# Altium schematic sheet Input.SchDoc
size 420 x 297 mm; Address1: Address1; Address2: Address2; Address3: Address3; Address4: Address4; DocumentNumber: АБВГ.123456.001 Э3; SheetNumber: 1; Scale: 1:1; DocumentType: Схема электрическая принципиальная; FirstReferrence: АБВГ.123456.001
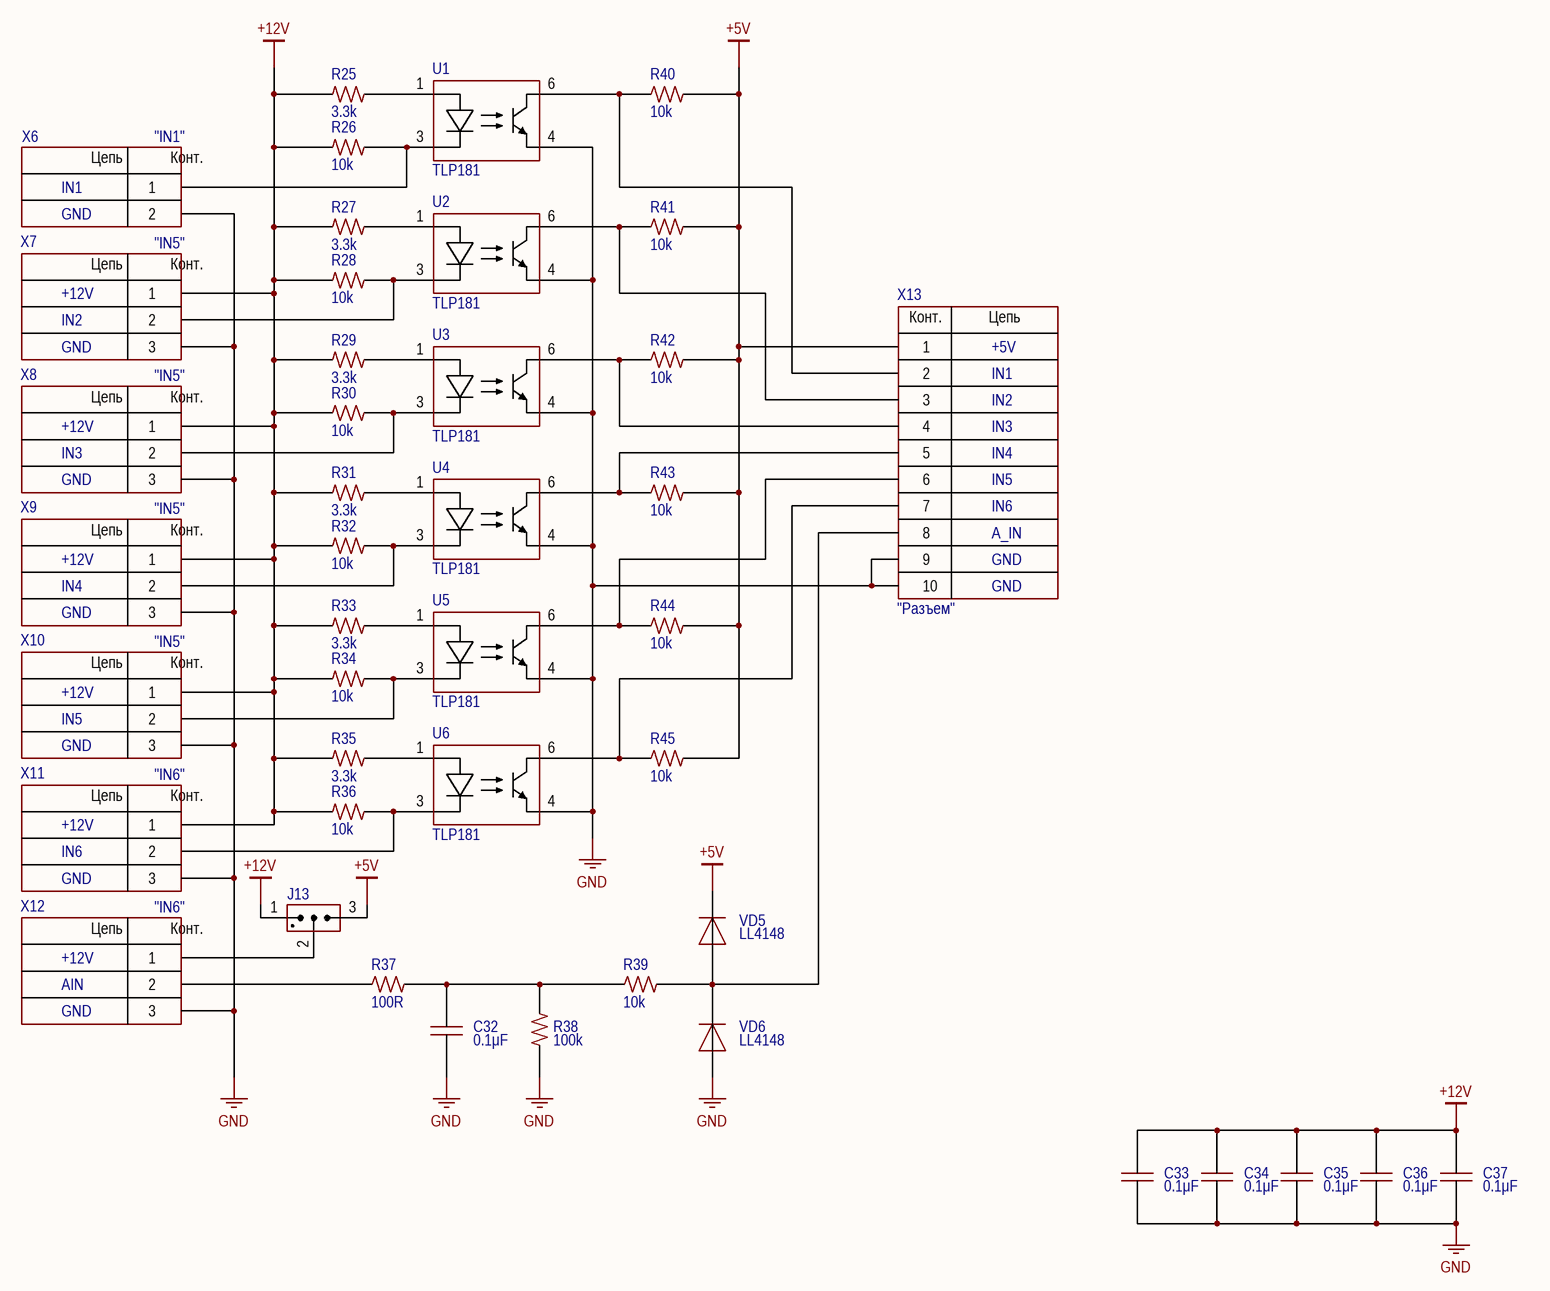
[diagram p0: Input.SchDoc]

## Parts
C32  value 0.1μF  [CAP: 0805]
C33  value 0.1μF  [CAP: 0805]
C34  value 0.1μF  [CAP: 0805]
C35  value 0.1μF  [CAP: 0805]
C36  value 0.1μF  [CAP: 0805]
C37  value 0.1μF  [CAP: 0805]
J13  (no value)  [CON: PLS-3]
R25  Значение: 3.3k  [RES: 0805]  (hidden comment: Резистор SMD)
R26  Значение: 10k  [RES: 0805]  (hidden comment: Резистор SMD)
R27  Значение: 3.3k  [RES: 0805]  (hidden comment: Резистор SMD)
R28  Значение: 10k  [RES: 0805]  (hidden comment: Резистор SMD)
R29  Значение: 3.3k  [RES: 0805]  (hidden comment: Резистор SMD)
R30  Значение: 10k  [RES: 0805]  (hidden comment: Резистор SMD)
R31  Значение: 3.3k  [RES: 0805]  (hidden comment: Резистор SMD)
R32  Значение: 10k  [RES: 0805]  (hidden comment: Резистор SMD)
R33  Значение: 3.3k  [RES: 0805]  (hidden comment: Резистор SMD)
R34  Значение: 10k  [RES: 0805]  (hidden comment: Резистор SMD)
R35  Значение: 3.3k  [RES: 0805]  (hidden comment: Резистор SMD)
R36  Значение: 10k  [RES: 0805]  (hidden comment: Резистор SMD)
R37  Значение: 100R  [RES: 0805]  (hidden comment: Резистор SMD)
R38  Значение: 100k  [RES: 0805]  (hidden comment: Резистор SMD)
R39  Значение: 10k  [RES: 0805]  (hidden comment: Резистор SMD)
R40  Значение: 10k  [RES: 0805]  (hidden comment: Резистор SMD)
R41  Значение: 10k  [RES: 0805]  (hidden comment: Резистор SMD)
R42  Значение: 10k  [RES: 0805]  (hidden comment: Резистор SMD)
R43  Значение: 10k  [RES: 0805]  (hidden comment: Резистор SMD)
R44  Значение: 10k  [RES: 0805]  (hidden comment: Резистор SMD)
R45  Значение: 10k  [RES: 0805]  (hidden comment: Резистор SMD)
U1  (no value)  [OPTO: TLP181]
U2  (no value)  [OPTO: TLP181]
U3  (no value)  [OPTO: TLP181]
U4  (no value)  [OPTO: TLP181]
U5  (no value)  [OPTO: TLP181]
U6  (no value)  [OPTO: TLP181]
VD5  PartNumber: LL4148  [DIODE: SOD80]
VD6  PartNumber: LL4148  [DIODE: SOD80]
X6  CommentText: "IN1"  [CON: 15EDGVC-3.5-02 (or 691321100002)]
X7  CommentText: "IN5"  [CON: 15EDGVC-3.5-03 (or 691321100003)]
X8  CommentText: "IN5"  [CON: 15EDGVC-3.5-03 (or 691321100003)]
X9  CommentText: "IN5"  [CON: 15EDGVC-3.5-03 (or 691321100003)]
X10  CommentText: "IN5"  [CON: 15EDGVC-3.5-03 (or 691321100003)]
X11  CommentText: "IN6"  [CON: 15EDGVC-3.5-03 (or 691321100003)]
X12  CommentText: "IN6"  [CON: 15EDGVC-3.5-03 (or 691321100003)]
X13  CommentText: "Разъем"  [CON: PLS-10]

## Nets
+5V: J13.3(IN) R40.2 R41.2 R42.2 R43.2 R44.2 R45.2 VD5.2 X13.1
+12V: C33.2 C34.2 C35.2 C36.2 C37.2 J13.1(IN) R25.1 R26.1 R27.1 R28.1 R29.1 R30.1 R31.1 R32.1 R33.1 R34.1 R35.1 R36.1 X7.1 X8.1 X9.1 X10.1 X11.1
GND: C32.1 C33.1 C34.1 C35.1 C36.1 C37.1 R38.1 U1.4(E) U2.4(E) U3.4(E) U4.4(E) U5.4(E) U6.4(E) VD6.1 X6.2 X7.3 X8.3 X9.3 X10.3 X11.3 X12.3 X13.9 X13.10
NetC32_2: C32.2 R37.2 R38.2 R39.1
NetJ13_2: J13.2(IN) X12.1
NetR25_2: R25.2 U1.1(A)
NetR26_2: R26.2 U1.3(C) X6.1
NetR27_2: R27.2 U2.1(A)
NetR28_2: R28.2 U2.3(C) X7.2
NetR29_2: R29.2 U3.1(A)
NetR30_2: R30.2 U3.3(C) X8.2
NetR31_2: R31.2 U4.1(A)
NetR32_2: R32.2 U4.3(C) X9.2
NetR33_2: R33.2 U5.1(A)
NetR34_2: R34.2 U5.3(C) X10.2
NetR35_2: R35.2 U6.1(A)
NetR36_2: R36.2 U6.3(C) X11.2
NetR37_1: R37.1 X12.2
NetR39_2: R39.2 VD5.1 VD6.2 X13.8
NetR40_1: R40.1 U1.6(C) X13.2
NetR41_1: R41.1 U2.6(C) X13.3
NetR42_1: R42.1 U3.6(C) X13.4
NetR43_1: R43.1 U4.6(C) X13.5
NetR44_1: R44.1 U5.6(C) X13.6
NetR45_1: R45.1 U6.6(C) X13.7

## Notes on the sheet
- GND
- IN1
- +12V
- IN2
- +5V
- IN3
- IN4
- IN5
- IN6
- A_IN
- AIN
- Подп. и дата
- Инв. № дубл.
- Взам. инв. №
- Инв. № подл.
- Изм.
- Лист
- № докум.
- Подп.
- Дата
- 2.106-A3
- Копировал
- Формат А3
- (in symbol Connector_terminal_2pin) Цепь; Конт.
- (in symbol Connector_terminal_3pin) Цепь; Конт.
- (in symbol PLS-10) Конт.; Цепь

## Library data of the parts
C32-C37 = Ceramic_0805: Manufacturer: Murata Electronics; PartNumber: GRM21BR71H104KA01L; ValueManufacturerPartNumber: Керамический конденсатор, 0.1μF, X7R, ±10%, 16V, 0805, -55...+125°C; TypeCapacitor: Керамический конденсатор; Tolerance: ±10%; TypeDielectric: X7R; Voltage: 16V; Package: 0805; HelpURL: https://www.digikey.com/product-detail/en/yageo/CC0805KRX7R7BB104/311-1142-1-ND/303052; Temperature: -55...+125°C
J13 = Jumper_3_pin: CommentText: "Перемычка"
R25-R45 = Резистор SMD: Производитель: YAGEO; УникальныйНомер: RC0201JR-07100RL; Типоразмер: 0201; Ссылка: ***; Точность: ±5%; ТипКомпонента: Резистор SMD
U1-U6 = TLP181: Optoisolator; Manufacturer: Toshiba; Supply: 80V; DataRate: 4µs/3µs; Isolation: 3750Vrms; Package: 11-4c1; ComponentType: IC optoisolator; Temperature: -40...+125°C; PartNumber: TLP181
VD5 VD6 = Diode_single: Manufacturer: Micro Commercial; ValueManufacturerPartNumber: Single diode, 75V, 150mA, 1V, 4ns, SOD-323, -55...+150°C; TypeDiode: Single diode; Voltage: 75V; Current: 150mA; VoltageDrop: 1V; RecoveryTime: 4ns; Package: SOD-323; HelpURL: https://www.digikey.com/product-detail/en/micro-commercial-co/1N4148WX-TP/1N4148WXTPMSCT-ND/717312; Temperature: -55...+150°C
X6 = Connector_terminal_2pin: Manufacturer: DEGSON; ValueManufacturerPartNumber: Клеммник, 2pin, 3.5mm, 300VAC, 10A; PartNumber: DG350-3.5-02P-14-00A(H); TypeConnector: Клеммник; VoltageMax: 300VAC; Pitch: 3.5mm; CurrentMax: 10A; Multichannel: 2pin; HelpURL: https://www.chipdip.ru/product/dg350-3.5-02p-12
X7-X12 = Connector_terminal_3pin: Manufacturer: Degson; ValueManufacturerPartNumber: Terminal connector, 3pin, 3.5mm, 300VAC, 10A; PartNumber: DG350-3.5-03P-14; TypeConnector: Terminal connector; VoltageMax: 300VAC; Pitch: 3.5mm; CurrentMax: 10A; Multichannel: 3pin; HelpURL: https://www.chipdip.ru/product/dg350-3.5-03p-12
X13 = PLS-10: Manufacturer: Connfly; ValueManufacturerPartNumber: Connector, 10pin, 2.54mm, 500VAC, 3A; TypeConnector: Connector; VoltageMax: 500VAC; Pitch: 2.54mm; CurrentMax: 3A; Multichannel: 10pin; HelpURL: https://www.chipdip.ru/product/pls-10; PartNumber: PLS-10